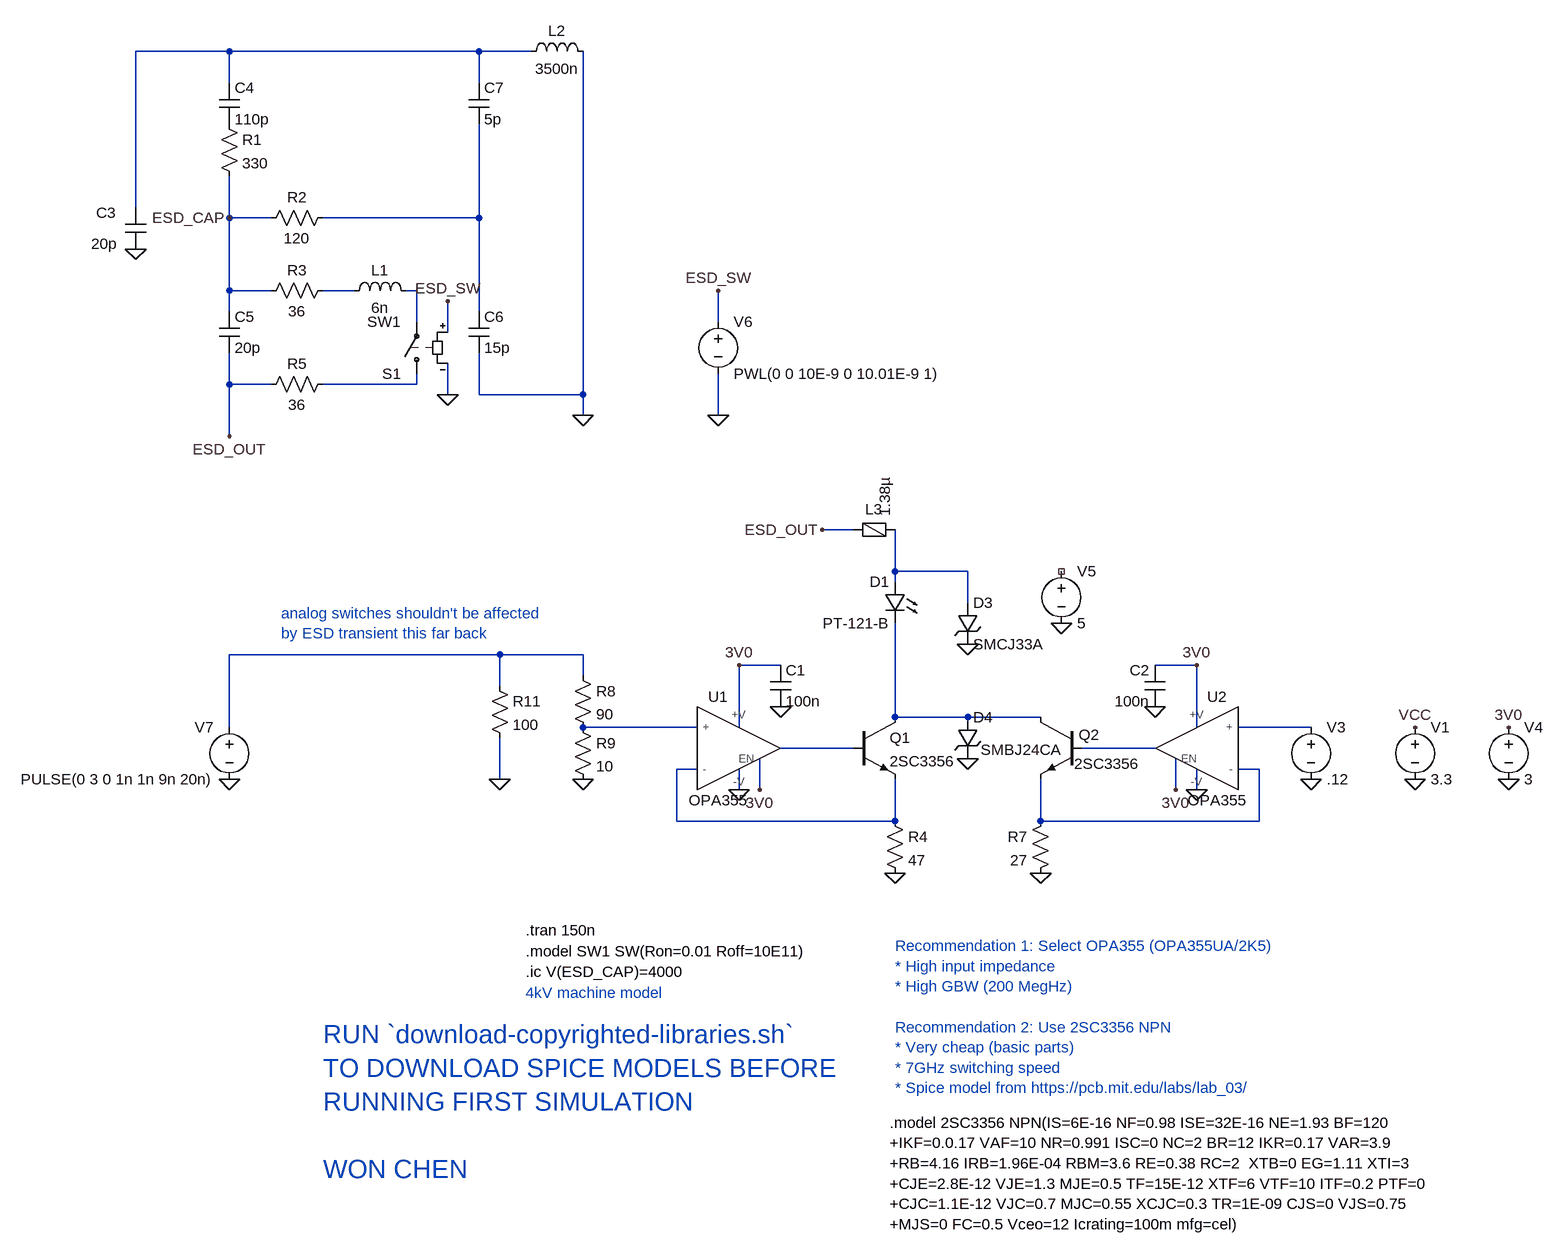
[diagram p0: schematic AAA_transmitter_laser_driver_simulation_esd_protection.asc]
AAA_transmitter_laser_driver_simulation_esd_protection.asc, the LTspice schematic file:
Version 4
SHEET 1 5336 1412
WIRE -1152 -1664 -1296 -1664
WIRE -768 -1664 -1152 -1664
WIRE -688 -1664 -768 -1664
WIRE -1152 -1616 -1152 -1664
WIRE -768 -1616 -768 -1664
WIRE -1296 -1424 -1296 -1664
WIRE -1152 -1408 -1152 -1472
WIRE -1088 -1408 -1152 -1408
WIRE -768 -1408 -768 -1552
WIRE -768 -1408 -1008 -1408
WIRE -1152 -1296 -1152 -1408
WIRE -1088 -1296 -1152 -1296
WIRE -960 -1296 -1008 -1296
WIRE -864 -1296 -880 -1296
WIRE -1152 -1264 -1152 -1296
WIRE -768 -1264 -768 -1408
WIRE -864 -1248 -864 -1296
WIRE -400 -1248 -400 -1296
WIRE -816 -1232 -816 -1280
WIRE -1152 -1152 -1152 -1200
WIRE -1088 -1152 -1152 -1152
WIRE -864 -1152 -864 -1168
WIRE -864 -1152 -1008 -1152
WIRE -816 -1136 -816 -1184
WIRE -768 -1136 -768 -1200
WIRE -608 -1136 -608 -1664
WIRE -608 -1136 -768 -1136
WIRE -608 -1104 -608 -1136
WIRE -400 -1104 -400 -1168
WIRE -1152 -1072 -1152 -1152
WIRE -192 -928 -240 -928
WIRE -128 -864 -128 -928
WIRE -16 -864 -128 -864
WIRE -128 -848 -128 -864
WIRE -16 -816 -16 -864
WIRE -736 -736 -1152 -736
WIRE -608 -736 -736 -736
WIRE -304 -720 -368 -720
WIRE 336 -720 272 -720
WIRE -608 -704 -608 -736
WIRE -736 -688 -736 -736
WIRE -128 -640 -128 -784
WIRE -16 -640 -128 -640
WIRE 96 -640 -16 -640
WIRE -1152 -624 -1152 -736
WIRE -432 -624 -608 -624
WIRE -368 -624 -368 -720
WIRE 336 -624 336 -720
WIRE 512 -624 400 -624
WIRE -192 -592 -304 -592
WIRE 272 -592 160 -592
WIRE -432 -560 -464 -560
WIRE 432 -560 400 -560
WIRE -736 -544 -736 -608
WIRE -368 -528 -368 -560
WIRE -336 -528 -336 -576
WIRE 304 -528 304 -576
WIRE 336 -528 336 -560
WIRE -464 -480 -464 -560
WIRE -128 -480 -128 -544
WIRE -128 -480 -464 -480
WIRE 96 -480 96 -544
WIRE 432 -480 432 -560
WIRE 432 -480 96 -480
FLAG 672 -544 0
FLAG 672 -624 VCC
FLAG 816 -544 0
FLAG 816 -624 3V0
FLAG -368 -528 0
FLAG -304 -656 0
FLAG -336 -528 3V0
FLAG 336 -528 0
FLAG 272 -656 0
FLAG 304 -528 3V0
FLAG 512 -544 0
FLAG -1152 -544 0
FLAG -608 -544 0
FLAG -736 -544 0
FLAG -368 -720 3V0
FLAG 336 -720 3V0
FLAG -16 -752 0
FLAG -16 -576 0
FLAG -128 -400 0
FLAG 96 -400 0
FLAG 128 -784 0
FLAG -608 -1104 0
FLAG -1296 -1360 0
FLAG -1152 -1072 ESD_OUT
FLAG -816 -1136 0
FLAG -1152 -1408 ESD_CAP
FLAG -400 -1296 ESD_SW
FLAG -400 -1104 0
FLAG -816 -1280 ESD_SW
FLAG -240 -928 ESD_OUT
SYMBOL voltage 672 -640 R0
WINDOW 123 0 0 Left 0
WINDOW 39 0 0 Left 0
SYMATTR InstName V1
SYMATTR Value 3.3
SYMBOL voltage 816 -640 R0
WINDOW 123 0 0 Left 0
WINDOW 39 0 0 Left 0
SYMATTR InstName V4
SYMATTR Value 3
SYMBOL res -144 -496 R0
SYMATTR InstName R4
SYMATTR Value 47
SYMBOL cap -320 -720 R0
SYMATTR InstName C1
SYMATTR Value 100n
SYMBOL OPA355 -400 -592 R0
SYMATTR InstName U1
SYMBOL res 112 -496 M0
SYMATTR InstName R7
SYMATTR Value 27
SYMBOL cap 288 -720 M0
SYMATTR InstName C2
SYMATTR Value 100n
SYMBOL OPA355 368 -592 M0
SYMATTR InstName U2
SYMBOL voltage 512 -640 R0
WINDOW 123 0 0 Left 0
WINDOW 39 0 0 Left 0
SYMATTR InstName V3
SYMATTR Value .12
SYMBOL voltage -1152 -640 M0
WINDOW 123 0 0 Left 0
WINDOW 39 0 0 Left 0
SYMATTR InstName V7
SYMATTR Value PULSE(0 3 0 1n 1n 9n 20n)
SYMBOL res -624 -720 R0
SYMATTR InstName R8
SYMATTR Value 90
SYMBOL res -624 -640 R0
SYMATTR InstName R9
SYMATTR Value 10
SYMBOL res -752 -704 R0
SYMATTR InstName R11
SYMATTR Value 100
SYMBOL npn -192 -640 R0
SYMATTR InstName Q1
SYMATTR Value 2SC3356
SYMBOL npn 160 -640 M0
WINDOW 0 -27 27 Left 2
WINDOW 3 -88 72 Left 2
SYMATTR InstName Q2
SYMATTR Value 2SC3356
SYMBOL TVSdiode -32 -816 R0
SYMATTR InstName D3
SYMATTR Value SMCJ33A
SYMBOL TVSdiode -32 -640 R0
WINDOW 3 36 50 Left 2
SYMATTR Value SMBJ24CA
SYMATTR InstName D4
SYMBOL voltage 128 -880 R0
WINDOW 123 0 0 Left 0
WINDOW 39 0 0 Left 0
SYMATTR InstName V5
SYMATTR Value 5
SYMBOL LED -112 -848 M0
SYMATTR InstName D1
SYMATTR Value PT-121-B
SYMATTR Description Diode
SYMATTR Type diode
SYMBOL cap -1312 -1424 R0
WINDOW 0 -45 8 Left 2
WINDOW 3 -53 56 Left 2
SYMATTR InstName C3
SYMATTR Value 20p
SYMBOL cap -1168 -1616 R0
SYMATTR InstName C4
SYMATTR Value 110p
SYMBOL res -1168 -1568 R0
SYMATTR InstName R1
SYMATTR Value 330
SYMBOL res -992 -1424 R90
WINDOW 0 0 56 VBottom 2
WINDOW 3 32 56 VTop 2
SYMATTR InstName R2
SYMATTR Value 120
SYMBOL res -992 -1312 R90
WINDOW 0 0 56 VBottom 2
WINDOW 3 32 56 VTop 2
SYMATTR InstName R3
SYMATTR Value 36
SYMBOL res -992 -1168 R90
WINDOW 0 0 56 VBottom 2
WINDOW 3 32 56 VTop 2
SYMATTR InstName R5
SYMATTR Value 36
SYMBOL cap -1168 -1264 R0
SYMATTR InstName C5
SYMATTR Value 20p
SYMBOL ind -976 -1280 R270
WINDOW 0 32 56 VTop 2
WINDOW 3 5 56 VBottom 2
SYMATTR InstName L1
SYMATTR Value 6n
SYMBOL cap -784 -1264 R0
SYMATTR InstName C6
SYMATTR Value 15p
SYMBOL cap -784 -1616 R0
SYMATTR InstName C7
SYMATTR Value 5p
SYMBOL ind -704 -1648 R270
WINDOW 0 32 56 VTop 2
WINDOW 3 5 56 VBottom 2
SYMATTR InstName L2
SYMATTR Value 3500n
SYMBOL sw -864 -1152 R180
SYMATTR InstName S1
SYMATTR Value SW1
SYMBOL voltage -400 -1264 R0
WINDOW 123 0 0 Left 0
WINDOW 39 0 0 Left 0
SYMATTR InstName V6
SYMATTR Value PWL(0 0 10E-9 0 10.01E-9 1)
SYMBOL FerriteBead -160 -928 R270
WINDOW 0 16 0 VTop 2
SYMATTR InstName L3
SYMATTR Value 1.38µ
SYMATTR SpiceLine Ipk=1 Rser=0.2 Rpar=813 Cpar=617f mfg="Würth Elektronik" pn="742792651 WE-CBF 0603"
TEXT -696 -312 Left 2 !.tran 150n
TEXT -128 -288 Left 2 ;Recommendation 1: Select OPA355 (OPA355UA/2K5)\n* High input impedance\n* High GBW (200 MegHz)\n \nRecommendation 2: Use 2SC3356 NPN\n* Very cheap (basic parts)\n* 7GHz switching speed\n* Spice model from https://pcb.mit.edu/labs/lab_03/
TEXT -136 -16 Left 2 !.model 2SC3356 NPN(IS=6E-16 NF=0.98 ISE=32E-16 NE=1.93 BF=120 \n+IKF=0.0.17 VAF=10 NR=0.991 ISC=0 NC=2 BR=12 IKR=0.17 VAR=3.9 \n+RB=4.16 IRB=1.96E-04 RBM=3.6 RE=0.38 RC=2  XTB=0 EG=1.11 XTI=3 \n+CJE=2.8E-12 VJE=1.3 MJE=0.5 TF=15E-12 XTF=6 VTF=10 ITF=0.2 PTF=0 \n+CJC=1.1E-12 VJC=0.7 MJC=0.55 XCJC=0.3 TR=1E-09 CJS=0 VJS=0.75 \n+MJS=0 FC=0.5 Vceo=12 Icrating=100m mfg=cel)
TEXT -1072 -800 Left 2 ;analog switches shouldn't be affected\nby ESD transient this far back
TEXT -696 -280 Left 2 !.model SW1 SW(Ron=0.01 Roff=10E11)
TEXT -696 -248 Left 2 !.ic V(ESD_CAP)=4000
TEXT -696 -216 Left 2 ;4kV machine model
TEXT -1008 -152 Left 4 ;RUN `download-copyrighted-libraries.sh`\nTO DOWNLOAD SPICE MODELS BEFORE\nRUNNING FIRST SIMULATION\n \nWON CHEN

The netlist it stands for:
* AAA_transmitter_laser_driver_simulation_esd_protection.asc
V1 VCC 0 3.3
V4 3V0 0 3
R4 N013 0 47
C1 3V0 0 100n
XU1 N011 0 N009 N013 3V0 3V0 OPA355  ; pins OUT -V + - EN +V
R7 N014 0 27
C2 3V0 0 100n
XU2 N012 0 N010 N014 3V0 3V0 OPA355  ; pins OUT -V + - EN +V
V3 N010 0 .12
V7 N007 0 PULSE(0 3 0 1n 1n 9n 20n)
R8 N007 N009 90
R9 N009 0 10
R11 N007 0 100
Q1 N008 N011 N013 0 2SC3356
Q2 N008 N012 N014 0 2SC3356
D3 N006 0 SMCJ33A
D4 N008 0 SMBJ24CA
V5 NC_01 0 5
D1 N006 N008 PT-121-B
C3 N001 0 20p
C4 N001 P001 110p
R1 P001 ESD_CAP 330
R2 N002 ESD_CAP 120
R3 N003 ESD_CAP 36
R5 N005 ESD_OUT 36
C5 ESD_CAP ESD_OUT 20p
L1 N003 N004 6n
C6 N002 0 15p
C7 N001 N002 5p
L2 N001 0 3500n
S1 N005 N004 ESD_SW 0 SW1
V6 ESD_SW 0 PWL(0 0 10E-9 0 10.01E-9 1)
L3 ESD_OUT N006 1.38µ Ipk=1 Rser=0.2 Rpar=813 Cpar=617f mfg="Würth Elektronik" pn="742792651 WE-CBF 0603"
.model D D
.lib standard.dio
.model NPN NPN
.model PNP PNP
.lib standard.bjt
.tran 150n
* Recommendation 1: Select OPA355 (OPA355UA/2K5)
* * High input impedance
* * High GBW (200 MegHz)
* Recommendation 2: Use 2SC3356 NPN
* * Very cheap (basic parts)
* * 7GHz switching speed
* * Spice model from https://pcb.mit.edu/labs/lab_03/
.model 2SC3356 NPN(IS=6E-16 NF=0.98 ISE=32E-16 NE=1.93 BF=120
+IKF=0.0.17 VAF=10 NR=0.991 ISC=0 NC=2 BR=12 IKR=0.17 VAR=3.9
+RB=4.16 IRB=1.96E-04 RBM=3.6 RE=0.38 RC=2  XTB=0 EG=1.11 XTI=3
+CJE=2.8E-12 VJE=1.3 MJE=0.5 TF=15E-12 XTF=6 VTF=10 ITF=0.2 PTF=0
+CJC=1.1E-12 VJC=0.7 MJC=0.55 XCJC=0.3 TR=1E-09 CJS=0 VJS=0.75
+MJS=0 FC=0.5 Vceo=12 Icrating=100m mfg=cel)
* analog switches shouldn't be affected
* by ESD transient this far back
.model SW1 SW(Ron=0.01 Roff=10E11)
.ic V(ESD_CAP)=4000
* 4kV machine model
* RUN `download-copyrighted-libraries.sh`
* TO DOWNLOAD SPICE MODELS BEFORE
* RUNNING FIRST SIMULATION
* WON CHEN
.lib OPA355.LIB
.backanno
.end